# EAGLE design RGB (EAGLE 9.4.1)
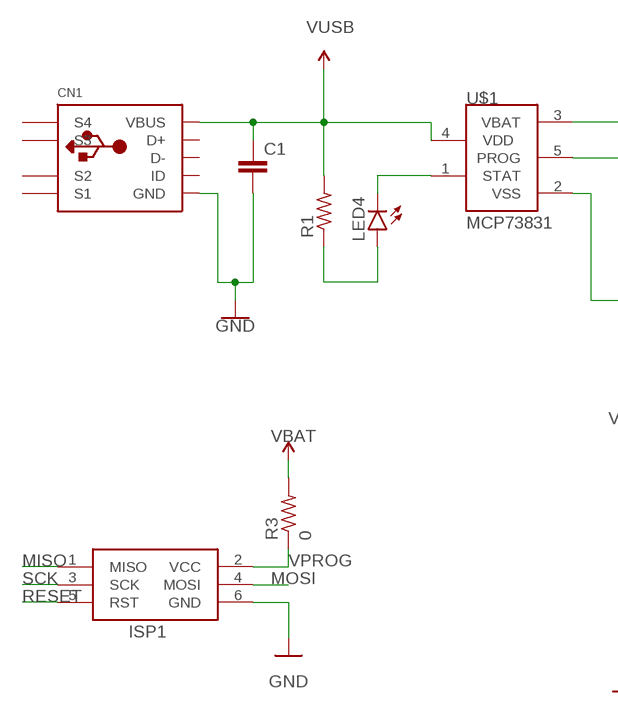
[diagram p0: schematic, sheet 1, part 1 of 2]
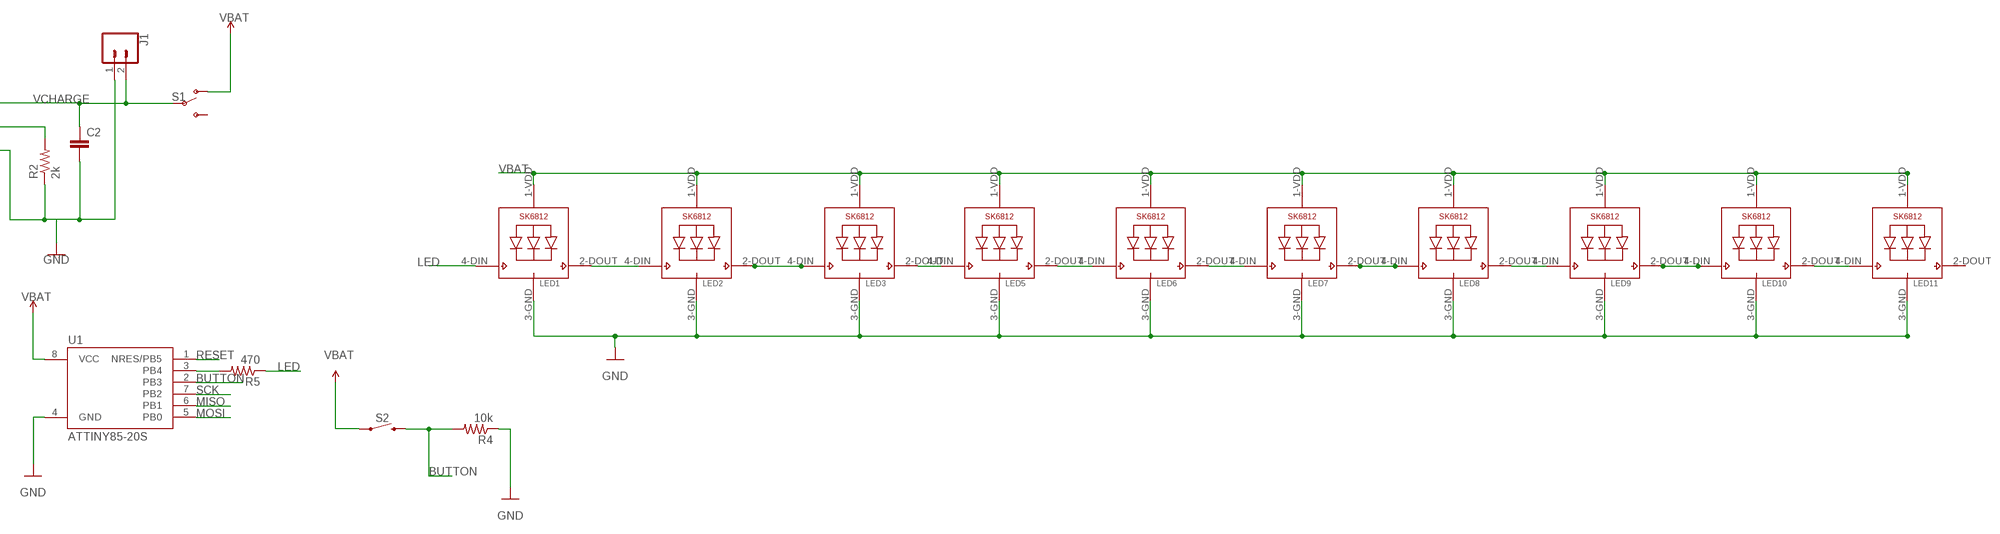
[diagram p1: schematic, sheet 1, part 2 of 2]

## Parts
C1  C-EUC0805K  [C0805K]
C2  C-EUC0805K  [C0805K]
CN1  USBMINIB  [USB-MINIB]
ISP1  AVRISP-6  [AVRISP]
J1  CONN_02  [1X02]
LED1  SK6812_5050W  [LED5050_W]
LED2  SK6812_5050W  [LED5050_W]
LED3  SK6812_5050W  [LED5050_W]
LED4  LEDCHIP-LED0805  [CHIP-LED0805]
LED5  SK6812_5050W  [LED5050_W]
LED6  SK6812_5050W  [LED5050_W]
LED7  SK6812_5050W  [LED5050_W]
LED8  SK6812_5050W  [LED5050_W]
LED9  SK6812_5050W  [LED5050_W]
LED10  SK6812_5050W  [LED5050_W]
LED11  SK6812_5050W  [LED5050_W]
R1  R-US_R0805  [R0805]
R2  2k  R-US_R0805  [R0805]
R3  0  R-US_R0805  [R0805]
R4  10k  R-US_R0805  [R0805]
R5  470  R-US_R0805  [R0805]
S1  SWITCH-SPDT-SMD-RIGHT-ANGLE  [SWITCH_SPST_SMD_A]
S2  MOMENTARY-SWITCH-SPST-SMD-5.2MM  [TACTILE_SWITCH_SMD_5.2MM]
U1  ATTINY85-20S  [SOIC8_EIAJ_208MIL]
U$1  MCP73831  [SOT23-5L]

## Nets
BUTTON: R4.2 S2.3 U1.2(PB3)
GND: C1.2 C2.2 CN1.GND ISP1.6(GND) J1.1 LED1.3-GND(GND) LED2.3-GND(GND) LED3.3-GND(GND) LED5.3-GND(GND) LED6.3-GND(GND) LED7.3-GND(GND) LED8.3-GND(GND) LED9.3-GND(GND) LED10.3-GND(GND) LED11.3-GND(GND) R2.1 R4.1 U1.4(GND) U$1.2(VSS)
LED: LED1.4-DIN(DI) R5.1
MISO: ISP1.1(MISO) U1.6(PB1)
MOSI: ISP1.4(MOSI) U1.5(PB0)
N$1: R2.2 U$1.5(PROG)
N$2: LED4.C U$1.1(STAT)
N$3: LED4.A R1.1
N$4: R5.2 U1.3(PB4)
N$5: LED1.2-DOUT(DO) LED2.4-DIN(DI)
N$6: LED2.2-DOUT(DO) LED3.4-DIN(DI)
N$7: LED3.2-DOUT(DO) LED5.4-DIN(DI)
N$8: LED5.2-DOUT(DO) LED6.4-DIN(DI)
N$9: LED6.2-DOUT(DO) LED7.4-DIN(DI)
N$10: LED7.2-DOUT(DO) LED8.4-DIN(DI)
N$11: LED8.2-DOUT(DO) LED9.4-DIN(DI)
N$12: LED9.2-DOUT(DO) LED10.4-DIN(DI)
N$13: LED10.2-DOUT(DO) LED11.4-DIN(DI)
RESET: ISP1.5(RST) U1.1(NRES/PB5)
SCK: ISP1.3(SCK) U1.7(PB2)
VBAT: LED1.1-VDD(VDD) LED2.1-VDD(VDD) LED3.1-VDD(VDD) LED5.1-VDD(VDD) LED6.1-VDD(VDD) LED7.1-VDD(VDD) LED8.1-VDD(VDD) LED9.1-VDD(VDD) LED10.1-VDD(VDD) LED11.1-VDD(VDD) R3.2 S1.1(O) S2.1 U1.8(VCC) ; supply symbol labelled 5V
VCHARGE: C2.1 J1.2 S1.2(P) U$1.3(VBAT)
VPROG: ISP1.2(VCC) R3.1
VUSB: C1.1 CN1.VBUS R1.2 U$1.4(VDD) ; supply symbol labelled 5V
Unconnected: CN1.D+ CN1.D- CN1.GND1(S1) CN1.GND2(S2) CN1.GND3(S3) CN1.GND4(S4) CN1.ID LED11.2-DOUT(DO) S1.3(S)

## Library data of the parts
C1 C2 = resistor:C-EU: CAPACITOR, European symbol
CN1 = microbuilder:USB: USB Connectors USBMINIB - Surface Mount Female Mini-B USB Connector 4UConnector: 06564
ISP1 = adafruit:AVRISP: AVR ISP HEADER Standard 6 pin header for AVR programming
J1 = SparkFun-Connectors:CONN_02: Multi connection point. Often used as Generic Header-pin footprint for 0.1 inch spaced/style header connections On any of the 0.1 inch spaced packages, you can populate with these: Break Away Headers - Straight <https://www.sparkfun.com/products/116> (PRT-00116) Break Away Male Headers - Right Angle <https://www.sparkfun.com/products/553> (PRT-00553) Female Headers <https://www.sparkfun.com/products/115> (PRT-00115) Break Away Headers - Machine Pin <https://www.sparkfun.com/products/117> (PRT-00117) Break Away Female Headers - Swiss Machine Pin <https://www.sparkfun.com/products/743> (PRT-00743) For SCREWTERMINALS and SPRING TERMINALS visit here: Screw Terimnals on SparkFun.com <https://www.sparkfun.com/search/results?term=Screw+Terminals> (5mm/3.5mm/2.54mm spacing) This device is also useful as a general connection point to wire up your design to another part of your project. Our various solder wires solder well into these plated through hole pads. Hook-Up Wire - Assortment (Stranded, 22 AWG) <https://www.sparkfun.com/products/11375> (PRT-11375) Hook-Up Wire - Assortment (Solid Core, 22 AWG) <https://www.sparkfun.com/products/11367> (PRT-11367) View the entire wire category on our website here <https://www.sparkfun.com/categories/141> Special notes: Molex polarized connector foot print use with: PRT-08233 with associated crimp pins and housings. 2.54_SCREWTERM for use with PRT-10571. 3.5mm Screw Terminal footprints for PRT-08084 5mm Screw Terminal footprints for use with PRT-08432
LED1-LED3 LED5-LED11 = SK6812:SK6812
LED4 = led:LED: LED OSRAM: - CHIPLED LG R971, LG N971, LY N971, LG Q971, LY Q971, LO R971, LY R971 LH N974, LH R974 LS Q976, LO Q976, LY Q976 LO Q996 - Hyper CHIPLED LW Q18S LB Q993, LB Q99A, LB R99A - SideLED LS A670, LO A670, LY A670, LG A670, LP A670 LB A673, LV A673, LT A673, LW A673 LH A674 LY A675 LS A676, LA A676, LO A676, LY A676, LW A676 LS A679, LY A679, LG A679 - Hyper Micro SIDELED® LS Y876, LA Y876, LO Y876, LY Y876 LT Y87S - SmartLED LW L88C, LW L88S LB L89C, LB L89S, LG L890 LS L89K, LO L89K, LY L89K LS L896, LA L896, LO L896, LY L896 - TOPLED LS T670, LO T670, LY T670, LG T670, LP T670 LSG T670, LSP T670, LSY T670, LOP T670, LYG T670 LG T671, LOG T671, LSG T671 LB T673, LV T673, LT T673, LW T673 LH T674 LS T676, LA T676, LO T676, LY T676, LB T676, LH T676, LSB T676, LW T676 LB T67C, LV T67C, LT T67C, LS T67K, LO T67K, LY T67K, LW E67C LS E67B, LA E67B, LO E67B, LY E67B, LB E67C, LV E67C, LT E67C LW T67C LS T679, LY T679, LG T679 LS T770, LO T770, LY T770, LG T770, LP T770 LB T773, LV T773, LT T773, LW T773 LH T774 LS E675, LA E675, LY E675, LS T675 LS T776, LA T776, LO T776, LY T776, LB T776 LHGB T686 LT T68C, LB T68C - Hyper Mini TOPLED® LB M676 - Mini TOPLED Santana® LG M470 LS M47K, LO M47K, LY M47K Source: http://www.osram.convergy.de LUXEON: - LUMILED® LXK2-PW12-R00, LXK2-PW12-S00, LXK2-PW14-U00, LXK2-PW14-V00 LXK2-PM12-R00, LXK2-PM12-S00, LXK2-PM14-U00 LXK2-PE12-Q00, LXK2-PE12-R00, LXK2-PE12-S00, LXK2-PE14-T00, LXK2-PE14-U00 LXK2-PB12-K00, LXK2-PB12-L00, LXK2-PB12-M00, LXK2-PB14-N00, LXK2-PB14-P00, LXK2-PB14-Q00 LXK2-PR12-L00, LXK2-PR12-M00, LXK2-PR14-Q00, LXK2-PR14-R00 LXK2-PD12-Q00, LXK2-PD12-R00, LXK2-PD12-S00 LXK2-PH12-R00, LXK2-PH12-S00 LXK2-PL12-P00, LXK2-PL12-Q00, LXK2-PL12-R00 Source: www.luxeon.com KINGBRIGHT: KA-3528ASYC Source: www.kingbright.com
R1-R5 = resistor:R-US_: RESISTOR, American symbol
S1 = SparkFun-Switches:SWITCH-SPDT: Single Pole, Double Throw (SPDT) Switch Single-pole, double-throw (SPDT) switch. Variant Overview SMD-AYZ0202 Surface Mount DPDT Switch <https://www.sparkfun.com/products/597> (COM-00597) Used on e.g. LilyPad Arduino USB - ATmega32U4 Board <https://www.sparkfun.com/products/12049> PTH-11.6X4.0MM SPDT Mini Power Switch <https://www.sparkfun.com/products/102> (COM-00102) Used on e.g. SparkFun Simon Says - Through-Hole Soldering Kit <https://www.sparkfun.com/products/10547> (KIT-10547) PTH-11.6X4.0MM-KIT KIT version of SPDT Mini Power Switch - Simplifies soldering by removing tStop of switch pins - only one side can be soldered. PTH-11.6X4.0MM-LOCK LOCK version of SPDT Mini Power Switch - Offset pins hold switch in place for easier soldering. SMD-RIGHT-ANGLE Surface Mount Right Angle Switch <https://www.sparkfun.com/products/10860> (COM-10860) Used on e.g. SparkFun ESP8266 Thing <https://www.sparkfun.com/products/13231>; PROD_ID: SWCH-10651; SF_SKU: COM-10860
S2 = SparkFun-Switches:MOMENTARY-SWITCH-SPST: Momentary Switch (Pushbutton) - SPST Normally-open (NO) SPST momentary switches (buttons, pushbuttons). Variants PTH-12MM - 12mm square, through-hole Momentary Pushbutton Switch - 12mm Square <https://www.sparkfun.com/products/9190> (COM-09190) PTH-6.0MM, PTH-6.0MM-KIT - 6.0mm square, through-hole Mini Pushbutton Switch <https://www.sparkfun.com/products/97> (COM-00097) KIT package intended for soldering kit's - only one side of pads' copper is exposed. PTH-RIGHT-ANGLE-KIT - Right-angle, through-hole Right Angle Tactile Button <https://www.sparkfun.com/products/10791> - Used on SparkFun BigTime Watch Kit <https://www.sparkfun.com/products/11734> SMD-12MM - 12mm square, surface-mount Tactile Button - SMD (12mm) <https://www.sparkfun.com/products/12993> (COM-12993) Used on SparkFun PicoBoard <https://www.sparkfun.com/products/11888> SMD-4.5MM - 4.5mm Square Trackball Switch Used on SparkFun Blackberry Trackballer Breakout <https://www.sparkfun.com/products/13169> SMD-4.6MMX2.8MM - 4.60mm x 2.80mm, surface mount Used on SparkFun SAMD21 Mini Breakout <https://www.sparkfun.com/products/13664> SMD-5.2MM, SMD-5.2-REDUNDANT - 5.2mm square, surface-mount Mini Pushbutton Switch - SMD <https://www.sparkfun.com/products/8720> (COM-08720) Used on Arduino Pro Mini <https://www.sparkfun.com/products/11114> REDUNDANT package connects both switch circuits together SMD-6.0X3.5MM - 6.0 x 3.5mm, surface mount Momentary Reset Switch SMD <https://www.sparkfun.com/products/8229> (COM-08229) SMD-6.2MM-TALL - 6.2mm square, surface mount Tactile Button - SMD (6mm) <https://www.sparkfun.com/products/12992> Used on SparkFun Digital Sandbox <https://www.sparkfun.com/products/12651> SMD-RIGHT-ANGLE - Right-angle, surface mount Used on SparkFun Block for Intel® Edison - Arduino <https://www.sparkfun.com/products/13036>; PROD_ID: SWCH-08247; SF_SKU: COM-08720
U1 = attiny25_45_85:ATTINY85*: ATMEL ATtiny 85 Packages: P = PDIP 08 30mil S = SOIC 08 EIAJ 208mil Technologies Note: for complete ordering code (temp. range, finish, tape&reel etc.) see www.atmel.com • Supply Voltage: V = (1.8…5.5)V | [blank] = (2.7…5.5)V • Speed: 10 = 10 MHz | 20 = 20 MHz Author: Dipl.-Ing. FH Rainer Bayer HHN Hochschule Heilbronn (Heilbronn University), rainer.bayer@hs-heilbronn.de Ingenieurbüro ing-rb, mail@ing-rb.de
U$1 = mcp73831:MCP73831: Miniature Single-Cell, Fully Integrated Li-Ion, Li-Polymer Charge Management Controllers

## Board
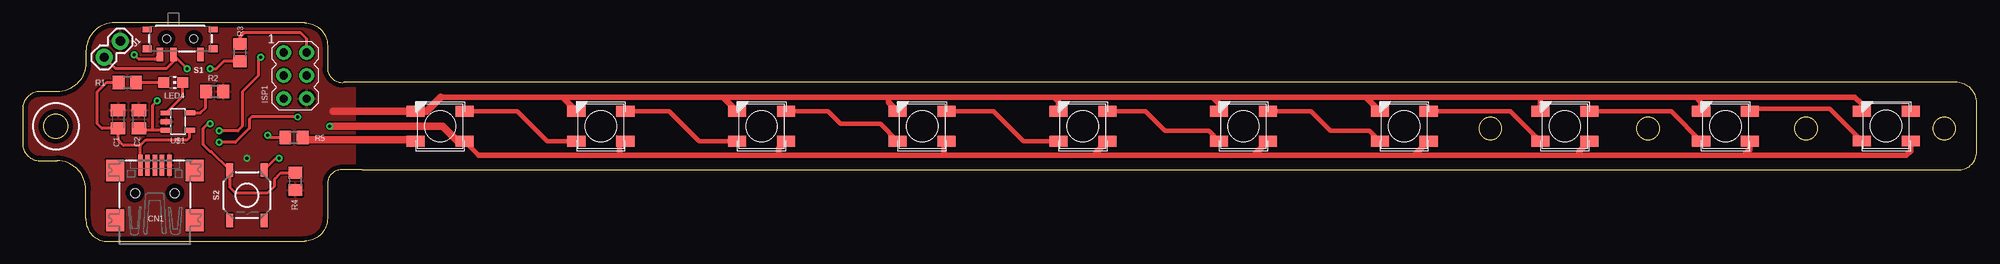
[diagram p2: board, top side]
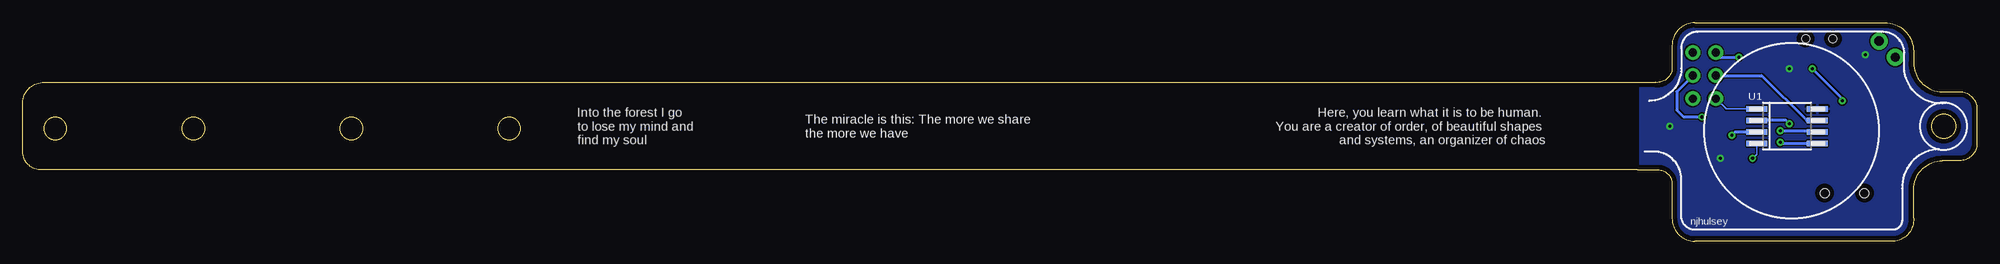
[diagram p3: board, bottom side, seen from below]

Size 215.77 x 24.13 mm. Coordinates in mm from the lower left corner, seen from the top.
Outline: 37.47,7.87 213.87,7.87 arc90 215.77,10.03 215.77,15.11 arc90 213.61,17.53 35.43,17.53 arc-90 33.66,19.05 33.66,21.59 arc90 31.11,24.13 10.16,24.13 arc90 6.99,20.96 6.99,19.69 arc-90 3.81,16.51 1.91,16.51 arc90 0,14.6 0,10.79 arc90 1.91,8.89 3.81,8.89 arc-90 6.99,5.71 6.99,2.54 arc90 9.21,0 31.11,0 arc90 33.66,2.54 33.66,6.35 arc-90 35.18,7.87 37.47,7.87
Outline: circle at 196.94,12.45 radius 1.25
Outline: circle at 179.5,12.45 radius 1.25
Outline: circle at 162.06,12.45 radius 1.25
Outline: circle at 3.64,12.7 radius 1.35
Outline: circle at 212.18,12.45 radius 1.25
Copper layers (1*16): Top 0.035mm / dielectric 1.5mm / Bottom 0.035mm
Design rules "default *": minimum track width 6mil, minimum drill 0.35mm, track to track 6mil, track to pad 6mil, pad to pad 6mil, via to via 6mil, smd to smd 6mil, copper to edge 20mil, drill to drill 6mil, minimum pad ring 10mil, minimum via ring 8mil, stop-mask expansion 4mil, vias tented up to drill 0mil, thermal gap 10mil
tKeepout: area 0.7,10.5 to 5.2,14.9; area 0.8,10.6 to 5,14.8
bKeepout: area 0.7,10.5 to 5.2,14.9

### Footprints (pad centres in the part's own frame; a part is rotated, then mirrored left to right if it is on the bottom)
C0805K = smd 1.3 x 1.6: 1 -1,0; 2 1,0
USB-MINIB = smd 0.5 x 2.308: D+ 0,4.064; D- -0.8,4.064; GND 1.6,4.064; ID 0.8,4.064; VBUS -1.6,4.064 | smd 2 x 2.4: GND1 -4.4,-2; GND2 -4.4,3.5; GND3 4.4,3.5; GND4 4.4,-2 | hole 1: -2.2,1; 2.2,1
AVRISP = drill 0.9 pad 1.626: 1 -1.27,2.54; 2 1.27,2.54; 3 -1.27,0; 4 1.27,0; 5 -1.27,-2.54; 6 1.27,-2.54
1X02 = drill 1.016 pad 1.88: 1 0,0; 2 2.54,0
LED5050_W = smd 2 x 1.2: 1-VDD 2.7,-1.65; 2-DOUT 2.7,1.65; 3-GND -2.7,1.65; 4-DIN -2.7,-1.65
CHIP-LED0805 = smd 1.2 x 1.2: A 0,-1.05; C 0,1.05
R0805 = smd 1.3 x 1.5: 1 -0.95,0; 2 0.95,0
SWITCH_SPST_SMD_A = smd 0.7 x 1.5: 1 -2.25,-1.75; 2 -0.75,-1.75; 3 2.25,-1.75 | smd 1 x 0.6: GND1 -3.65,1; GND3 3.65,1 | smd 1 x 0.8: GND2 -3.65,-1.1; GND4 3.65,-1.1 | hole 0.9: -1.5,0; 1.5,0
TACTILE_SWITCH_SMD_5.2MM = smd 1.524 x 0.762: 1 -2.794,1.905; 2 2.794,1.905; 3 -2.794,-1.905; 4 2.794,-1.905
SOIC8_EIAJ_208MIL = smd 0.6 x 2.286: 1 -1.905,-3.33; 2 -0.635,-3.33; 3 0.635,-3.33; 4 1.905,-3.33; 5 1.905,3.33; 6 0.635,3.33; 7 -0.635,3.33; 8 -1.905,3.33
SOT23-5L = smd 0.533 x 1.2: 1 -0.95,-1.3; 2 0,-1.3; 3 0.95,-1.3 | smd 0.55 x 1.2: 4 0.95,1.3; 5 -0.95,1.3

### Placement (x,y rotation side)
C1  10.54,13.46 90 top
C2  12.83,13.46 90 top
CN1  14.61,4.32 0 top
ISP1  30.1,18.29 0 top
J1  10.8,22.1 225 top
LED1  46.1,12.7 0 top
LED2  63.84,12.7 0 top
LED3  81.58,12.7 0 top
LED4  16.64,17.53 270 top
LED5  99.32,12.7 0 top
LED6  117.06,12.7 0 top
LED7  134.8,12.7 0 top
LED8  152.54,12.7 0 top
LED9  170.28,12.7 0 top
LED10  188.02,12.7 0 top
LED11  205.76,12.72 0 top
R1  11.56,17.53 180 top
R2  21.21,16.51 180 top
R3  24,20.83 270 top
R4  30.1,6.6 90 top
R5  29.97,11.43 180 top
S1  17.4,22.35 0 top
S2  24.77,5.08 270 top
U1  20.95,12.7 270 bottom
U$1  17.14,13.21 270 top

### Tracks (layer width: path | path; a pad name or v marks a point on that pad's centre or on a via)
BUTTON  (via drill 0.35)
  Top 0.305: R4.2 28.51,7.55 27.81,6.86 27.81,6.1 27.05,5.33 23.5,5.33 22.86,5.97 S2.3 20.83,9.91 20.7,9.91 19.94,10.67 19.94,12.45 20.45,12.95 v20.7,12.95
  Bottom 0.305: v20.7,12.95 21.08,13.33 U1.2
GND  (via drill 0.35)
  Top 0.152: 34.29,14.35 34.16,14.22 | 77.34,15.89 77.34,15.9 | 59.82,15.67 59.82,15.9
  Top 0.305: 167.58,15.58 167.26,15.9
  Top 0.61: 46.14,15.9 59.82,15.9 77.34,15.9 95.63,15.9 | 95.63,15.9 113.92,15.9 | 113.92,15.9 131.44,15.9 | 131.44,15.9 148.29,15.9 | 148.29,15.9 167.26,15.9 184.78,15.9 | 184.78,15.9 202.31,15.9 203.06,15.15 LED11.3-GND | LED10.3-GND 185.32,15.36 184.78,15.9 | LED9.3-GND 167.58,15.58 | LED8.3-GND 148.29,15.9 | LED7.3-GND 132.1,15.24 131.44,15.9 | LED6.3-GND 114.36,15.46 113.92,15.9 | LED5.3-GND 95.63,15.34 95.63,15.9 | LED3.3-GND 77.34,15.89 | LED2.3-GND 59.82,15.67
  Top 0.813: 34.29,14.35 LED1.3-GND 44.59,14.35 46.14,15.9
  Bottom 0.152: U1.4 24.29,9.62 v24.77,9.14
  pour Top: -1.14,-3.56 36.7,-3.56 36.7,27.56 -1.14,27.56
LED
  Top 0.152: 43.28,11.18 LED1.4-DIN
  Top 0.305: R5.1 31.18,11.18
  Top 0.813: 43.28,11.18 31.18,11.18
MISO  (via drill 0.35)
  Top 0.305: v26.29,20.32 26.04,20.07 26.04,18.29 24.26,16.51 24.26,12.7 23.75,12.19 v21.72,12.19
  Bottom 0.152: ISP1.1 28.32,20.32 | 18.16,12.19 18.03,12.06 U1.6
  Bottom 0.305: 28.32,20.32 v26.29,20.32 | v21.72,12.19 18.16,12.19
MOSI  (via drill 0.35)
  Top 0.305: v30.35,13.72 25.27,13.72 25.02,13.46 25.02,12.45 23.5,10.92 v21.72,10.92
  Bottom 0.152: v21.72,10.92 21.59,10.79
  Bottom 0.305: ISP1.4 33.15,16.51 33.15,14.48 32.39,13.72 v30.35,13.72 | 21.59,10.79 U1.5
N$1
  Top 0.152: 20.19,16.44 R2.2
  Top 0.305: U$1.5 19.62,14.16 20.19,14.73 20.19,16.44
N$2
  Top 0.305: U$1.1 17.69,16 LED4.C
N$3
  Top 0.305: R1.1 LED4.A
N$4  (via drill 0.35)
  Top 0.305: R5.2 27.3,11.43 v27.05,11.68
  Bottom 0.305: v27.05,11.68 26.67,12.06 U1.3
N$5
  Top 0.508: LED2.4-DIN 57.91,11.05 54.61,14.35 LED1.2-DOUT
N$6
  Top 0.508: LED3.4-DIN 74.67,11.05 71.38,14.35 LED2.2-DOUT
N$7
  Top 0.508: LED5.4-DIN 94.72,12.95 90.3,12.95 88.9,14.35 LED3.2-DOUT
N$8
  Top 0.508: LED6.4-DIN 110.49,11.05 107.19,14.35 LED5.2-DOUT
N$9
  Top 0.508: LED7.4-DIN 130.96,12.19 126.11,12.19 123.95,14.35 LED6.2-DOUT
N$10
  Top 0.508: LED8.4-DIN 148.7,12.19 144.4,12.19 142.24,14.35 LED7.2-DOUT
N$11
  Top 0.508: LED9.4-DIN 164.28,14.35 LED8.2-DOUT
N$12
  Top 0.508: LED10.4-DIN 182.02,14.35 LED9.2-DOUT
N$13
  Top 0.508: LED11.4-DIN 199.52,14.6 190.97,14.6 LED10.2-DOUT
RESET
  Bottom 0.152: ISP1.5 27.69,14.6 U1.1
SCK
  Bottom 0.305: ISP1.3 23.75,18.29 18.8,13.33 U1.7
VBAT  (via drill 0.35)
  Top 0.152: LED1.1-VDD 48.01,11.05 | LED5.1-VDD 101.73,10.76 | LED2.1-VDD 65.91,10.42
  Top 0.305: S1.1 14.61,20.07 12.83,20.07 v12.32,20.57 | S2.1 27.94,9.14 v28.32,9.14 | R3.2 22.22,19.88 21.4,19.05 v20.7,19.05 | 118.49,9.78 118.49,9.5
  Top 0.508: LED1.1-VDD 50.35,9.5
  Top 0.61: LED11.1-VDD 208.46,9.96 208,9.5 190.12,9.5 | 50.35,9.5 65.91,9.5 | 83.44,9.5 101.73,9.5 | 101.73,9.5 118.49,9.5 135.95,9.5 | 135.95,9.5 153.69,9.5 | 153.69,9.5 171.83,9.5 | 171.83,9.5 190.12,9.5 | LED10.1-VDD 190.72,10.1 190.12,9.5 | LED9.1-VDD 171.83,9.9 171.83,9.5 | LED8.1-VDD 153.69,9.5 | LED7.1-VDD 135.95,9.5 | LED6.1-VDD 118.49,9.78 | 101.73,10.76 101.73,9.5 | LED3.1-VDD 83.44,10.21 83.44,9.5 | 65.91,10.42 65.91,9.5 | 65.91,9.5 83.44,9.5
  Top 0.813: v33.91,12.7 46.36,12.7 48.01,11.05
  pour Bottom: -0.89,-2.03 37.21,-2.03 37.21,26.42 -0.89,26.42
VCHARGE  (via drill 0.35)
  Top 0.152: 13.03,12.26 C2.1 13.61,12.46 | S1.2 16.65,20.32 16.65,19.82
  Top 0.305: U$1.3 14.35,12.26 | 14.35,12.26 13.03,12.26 | 16.65,19.82 15.88,19.05 10.25,19.05 J1.2 | 14.35,12.26 14.35,14.99 v14.86,15.49 | v18.16,19.05 16.89,20.32 16.65,20.32
  Bottom 0.305: v14.86,15.49 14.86,15.75 v18.16,19.05
VPROG
  Top 0.305: ISP1.2 31.37,22.35 30.72,23 24.4,23
  Top 0.406: 24.4,23 24,22.61 R3.1
VUSB
  Top 0.152: 13,9.24 CN1.VBUS
  Top 0.305: CN1.VBUS 13,10.59 | 13,10.59 13.59,11.18 18.16,11.18 18.45,11.46 U$1.4 | 13,10.59 11.12,10.59 10.54,11.18 C1.1 8.75,12.46 8.25,12.95 8.25,16.51 9.27,17.53 R1.2

### Text on the board
bNames: Here, you learn what it is to be human. / You are a creator of order, of beautiful shapes / and systems, an organizer of chaos | The miracle is this: The more we share / the more we have | Into the forest I go / to lose my mind and / find my soul | njhulsey